# Altium schematic sheet OK1050-C_V1.2_NET.SchDoc
size A3; Revision: 1.2; SheetNumber: 7; SheetTotal: 7
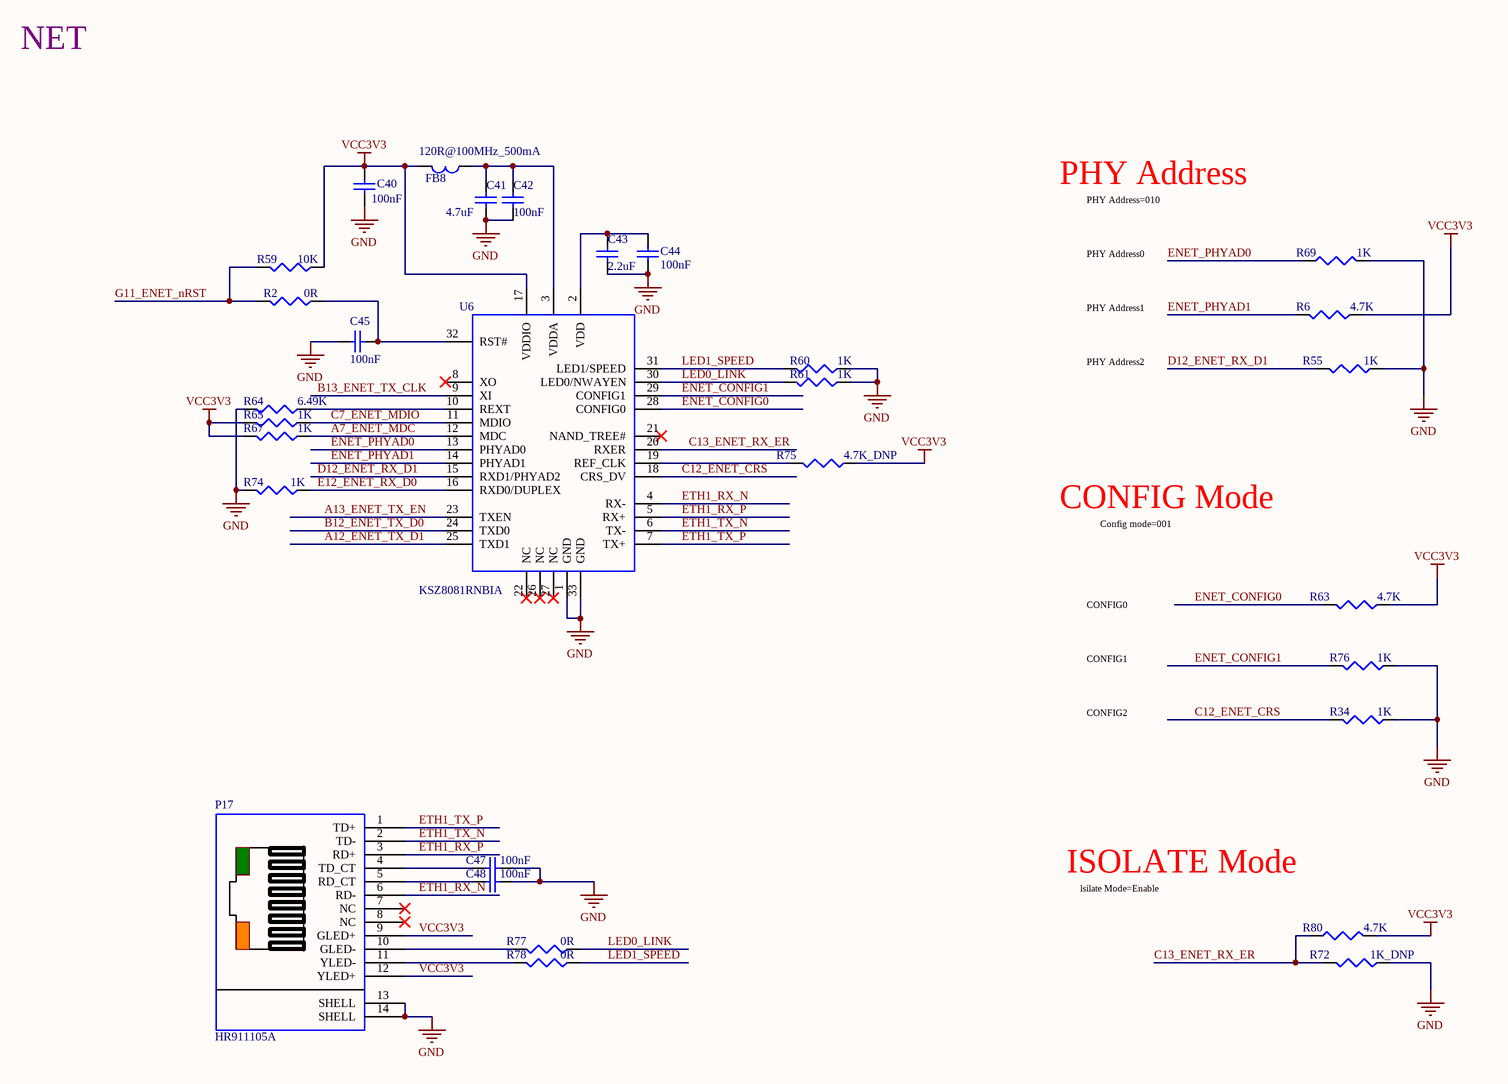
[diagram p0: OK1050-C_V1.2_NET.SchDoc]

## Parts
C40  100nF  [0603C+]
C41  4.7uF  [0603C+]
C42  100nF  [0603C+]
C43  2.2uF  [0603C+]
C44  100nF  [0603C+]
C45  100nF  [0603C+]
C47  100nF  [0603C+]
C48  100nF  [0603C+]
FB8  120R@100MHz_500mA  [0603R+]
P17  HR911105A  [RJ-45A12]
R2  0R  [0603R+]
R6  4.7K  [0603R+]
R34  1K  [0603R+]
R55  1K  [0603R+]
R59  10K  [0603R+]
R60  1K  [0603R+]
R61  1K  [0603R+]
R63  4.7K  [0603R+]
R64  6.49K  [0603R+]
R65  1K  [0603R+]
R67  1K  [0603R+]
R69  1K  [0603R+]
R72  1K_DNP  [0603R+]
R74  1K  [0603R+]
R75  4.7K_DNP  [0603R+]
R76  1K  [0603R+]
R77  0R  [0603R+]
R78  0R  [0603R+]
R80  4.7K  [0603R+]
U6  KSZ8081RNBIA  [QFN-32]

## Nets
GND: C40.2 C41.2 C42.2 C43.2 C44.2 C45.1 C47.1 C48.1 P17.13(SHELL) P17.14(SHELL) R34.1 R55.1 R60.1 R61.1 R64.2 R69.2 R72.1 R74.2 R76.1 U6.1(GND) U6.33(GND)
VCC3V3: C40.1 FB8.2 P17.9(GLED+) P17.12(YLED+) R6.1 R59.1 R63.1 R65.2 R67.2 R75.1 R80.2 U6.17(VDDIO)
A7_ENET_MDC: R67.1 U6.12(MDC)
A12_ENET_TX_D1: U6.25(TXD1)
A13_ENET_TX_EN: U6.23(TXEN)
B12_ENET_TX_D0: U6.24(TXD0)
B13_ENET_TX_CLK: U6.9(XI)
C7_ENET_MDIO: R65.1 U6.11(MDIO)
C12_ENET_CRS: R34.2 U6.18(CRS_DV)
C13_ENET_RX_ER: R72.2 R80.1 U6.20(RXER)
D12_ENET_RX_D1: R55.2 U6.15(RXD1/PHYAD2)
E12_ENET_RX_D0: R74.1 U6.16(RXD0/DUPLEX)
ENET_CONFIG0: R63.2 U6.28(CONFIG0)
ENET_CONFIG1: R76.2 U6.29(CONFIG1)
ENET_PHYAD0: R69.1 U6.13(PHYAD0)
ENET_PHYAD1: R6.2 U6.14(PHYAD1)
ETH1_RX_N: P17.6(RD-) U6.4(RX-)
ETH1_RX_P: P17.3(RD+) U6.5(RX+)
ETH1_TX_N: P17.2(TD-) U6.6(TX-)
ETH1_TX_P: P17.1(TD+) U6.7(TX+)
G11_ENET_nRST: R2.2 R59.2
LED0_LINK: R61.2 R77.1 U6.30(LED0/NWAYEN)
LED1_SPEED: R60.2 R78.1 U6.31(LED1/SPEED)
NetC41_1: C41.1 C42.1 FB8.1 U6.3(VDDA)
NetC43_1: C43.1 C44.1 U6.2(VDD)
NetC45_2: C45.2 R2.1 U6.32(RST#)
NetC47_2: C47.2 P17.4(TD_CT)
NetC48_2: C48.2 P17.5(RD_CT)
NetP17_10: P17.10(GLED-) R77.2
NetP17_11: P17.11(YLED-) R78.2
NetR64_1: R64.1 U6.10(REXT)
NetR75_2: R75.2 U6.19(REF_CLK)

Not connected (* = marked no-connect by the designer): P17 7(NC)* 8(NC)*; U6 8(XO)* 21(NAND_TREE#)* 22(NC)* 26(NC)* 27(NC)*

## Notes on the sheet
- NET
- PHY Address
- PHY Address=010
- PHY Address0
- PHY Address1
- PHY Address2
- CONFIG Mode
- Config mode=001
- CONFIG0
- CONFIG1
- CONFIG2
- ISOLATE Mode
- lsilate Mode=Enable
- 设计
- 审核
- 工艺
- 图纸名称
- 孙木
- 批准
- 标准化
- 日期
- 版本
- 页码
- 第
- 页
- 共

## Library data of the parts
C40-C45 C47 C48 = Cap: Capacitor; Published: 8-Jun-2000; LatestRevisionDate: 17-Jul-2002; LatestRevisionNote: Re-released for DXP Platform.; PackageReference: RAD-0.3; Publisher: Altium Limited; PackageDescription: Radial Cap, Thru-Hole; 2 Leads; 0.3 in Pin Spacing
  C40 C42 C44 C45 C47 C48: Value: 100nF
  C41: Value: 4.7uF
  C43: Value: 2.2uF
FB8 = CZ: Inductor; Code_IEC: 1005; Published: 8-Jun-2000; LatestRevisionDate: 29-May-2009; LatestRevisionNote: IPC-7351 Footprint Added.; PackageReference: 0402-A; Publisher: 120R@100MHz_500mA; PackageDescription: Chip Inductor; Code_JEITA: 0402; value: 120R@100MHz_500mA
R2 R6 R34 R55 R59-R61 R63-R65 R67 R69 R72 R74-R78 R80 = Res3: Resistor; Published: 8-Jun-2000; LatestRevisionDate: 29-May-2009; LatestRevisionNote: IPC-7351 Footprint Added.; PackageReference: J1-0603; Publisher: Altium Limited; PackageDescription: Chip Resistor
  R2 R77 R78: Value: 0R
  R6 R63 R80: Value: 4.7K
  R34 R55 R60 R61 R65 R67 R69 R74 R76: Value: 1K
  R59: Value: 10K
  R64: Value: 6.49K
  R72: Value: 1K_DNP
  R75: Value: 4.7K_DNP
U6 = KSZ8081RNB